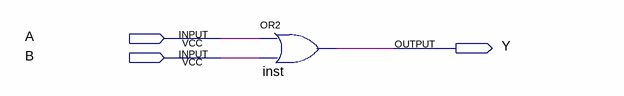
[diagram p0: schematic sheet]
// Quartus schematic CONG_OR.bdf as structural Verilog: 1 symbols, 3 pins
module CONG_OR (
  input  A,
  input  B,
  output Y
);

  or inst (Y, A, B);
endmodule
